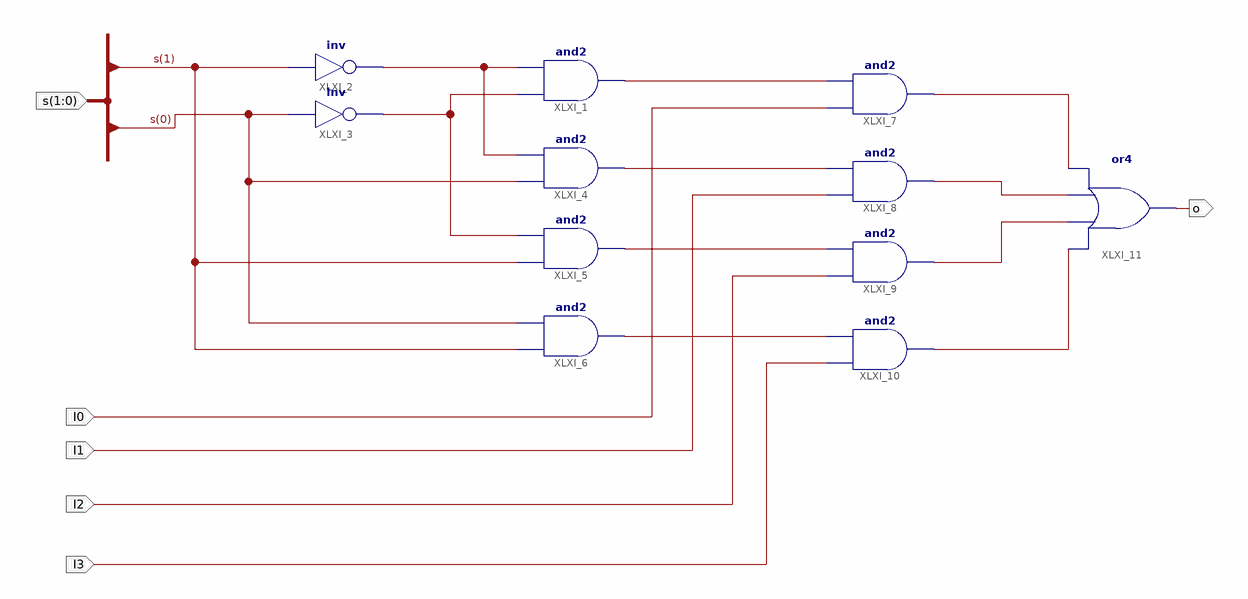
[diagram p0: schematic sheet 1]
// Xilinx ISE schematic Mux4to1.sch (kintex7) as structural Verilog: 11 symbols, 6 ports
module Mux4to1 (
  input  [1:0] s,
  input  I0,
  input  I1,
  input  I2,
  input  I3,
  output o
);

  wire XLXN_8, XLXN_9, XLXN_10, XLXN_11, XLXN_12, XLXN_13, XLXN_18, XLXN_20, XLXN_21, XLXN_22;

  and XLXI_1 (XLXN_10, XLXN_9, XLXN_8);
  not XLXI_2 (XLXN_8, s[1]);
  not XLXI_3 (XLXN_9, s[0]);
  and XLXI_4 (XLXN_11, s[0], XLXN_8);
  and XLXI_5 (XLXN_12, s[1], XLXN_9);
  and XLXI_6 (XLXN_13, s[1], s[0]);
  and XLXI_7 (XLXN_18, I0, XLXN_10);
  and XLXI_8 (XLXN_20, I1, XLXN_11);
  and XLXI_9 (XLXN_21, I2, XLXN_12);
  and XLXI_10 (XLXN_22, I3, XLXN_13);
  or XLXI_11 (o, XLXN_22, XLXN_21, XLXN_20, XLXN_18);
endmodule
